# EAGLE design LPC_2TE_3.4H (EAGLE 5.00)
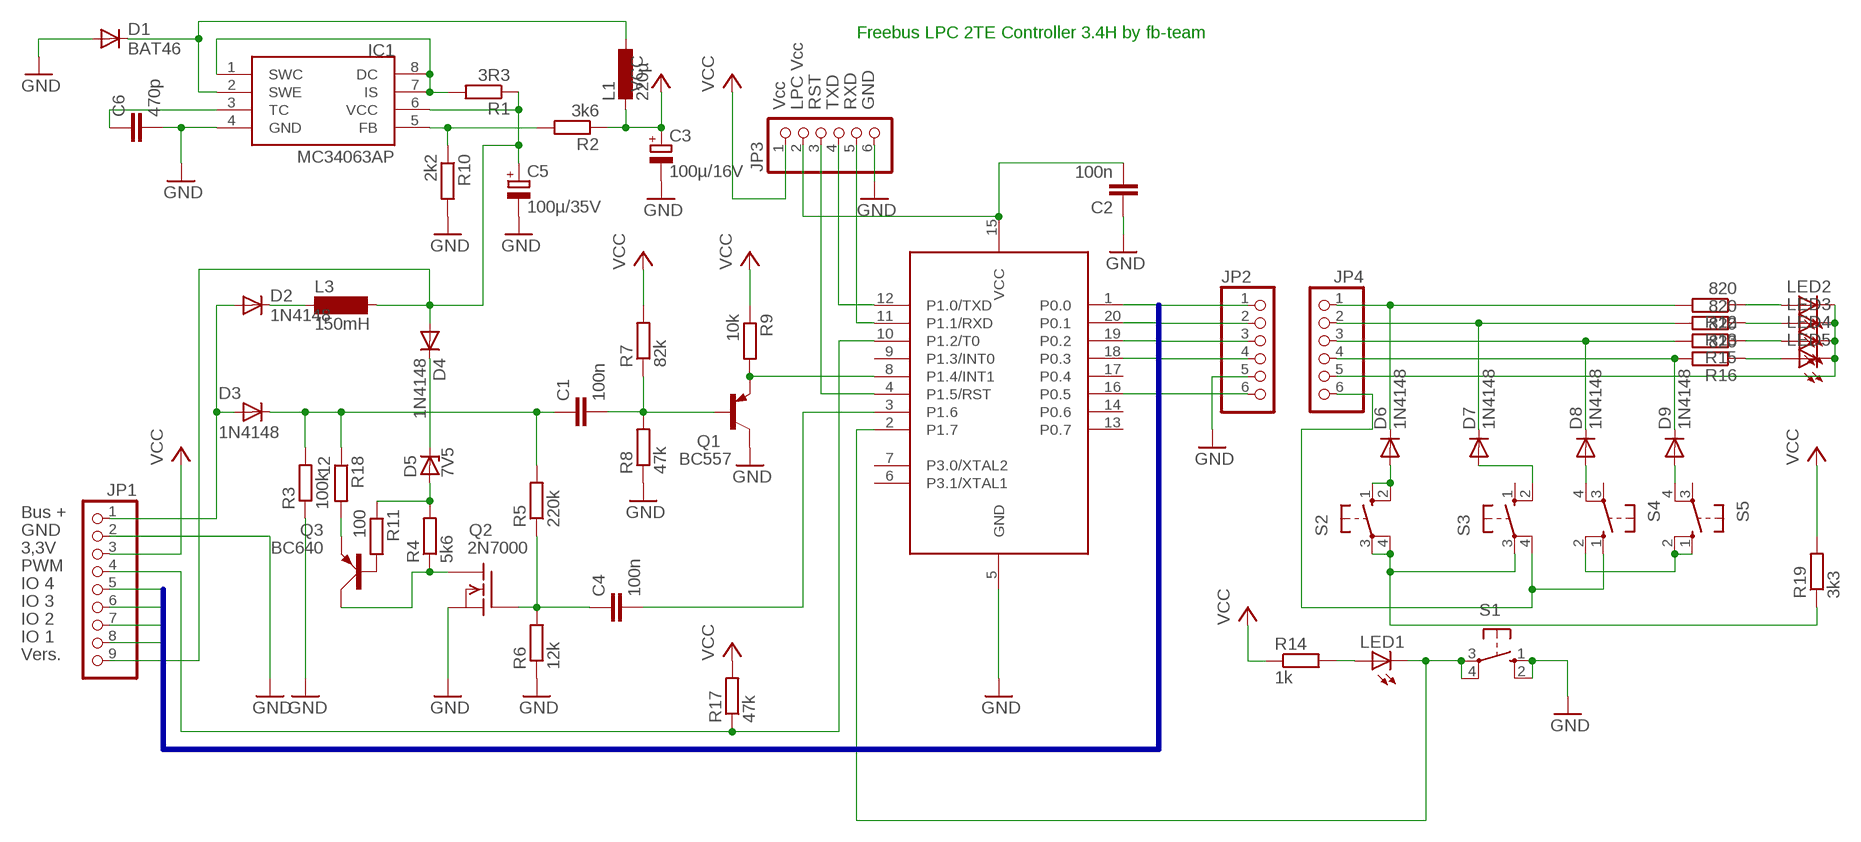
[diagram p0: schematic, sheet 1]

## Parts
C1  100n  C-EU050-024X044  [C050-024X044]
C2  100n  C-EU050-024X044  [C050-024X044]
C3  100µ/16V  CPOL-EUE3.5-8  [E3,5-8]
C4  100n  C-EU050-024X044  [C050-024X044]
C5  100µ/35V  CPOL-EUE3.5-8  [E3,5-8]
C6  470p  C-EU025-024X044  [C025-024X044]
D1  BAT46  BAT81  [DO34-7]
D2  1N4148  [DO35-10]
D3  1N4148  DO35-STEHEND  [DO35-S]
D4  1N4148  [DO35-10]
D5  7V5  ZPD  [DO35Z10]
D6  1N4148  [DO35-10]
D7  1N4148  [DO35-10]
D8  1N4148  [DO35-10]
D9  1N4148  [DO35-10]
IC1  MC34063AP  [DIL08]
JP1  PINHD-1X9  [1X09]
JP2  PINHD-1X6  [1X06]
JP3  PINHD-1X6  [1X06]
JP4  PINHD-1X6  [1X06]
L1  220µ  L-EU0207/2V  [0207/2V]
L3  150mH  BS11  [BS11]
LED1  LED3MM  [LED3MM]
LED2  LED3MM  [LED3MM]
LED3  LED3MM  [LED3MM]
LED4  LED3MM  [LED3MM]
LED5  LED3MM  [LED3MM]
Q1  BC557  [TO92]
Q2  2N7000  VN2222KM  [TO237]
Q3  BC640  [SOT54D]
R1  3R3  R-EU_0207/2V  [0207/2V@1]
R2  3k6  R-EU_0207/2V  [0207/2V@1]
R3  100k  R-EU_0207/2V  [0207/2V@1]
R4  5k6  R-EU_0207/2V  [0207/2V@1]
R5  220k  R-EU_0207/2V  [0207/2V@1]
R6  12k  R-EU_0207/2V  [0207/2V@1]
R7  82k  R-EU_0207/2V  [0207/2V@1]
R8  47k  R-EU_0207/2V  [0207/2V@1]
R9  10k  R-EU_0207/2V  [0207/2V@1]
R10  2k2  R-EU_0207/2V  [0207/2V@1]
R11  100  R-EU_0207/2V  [0207/2V@1]
R12  820  R-EU_0207/10  [0207/10@1]
R13  820  R-EU_0207/10  [0207/10@1]
R14  1k  R-EU_0207/2V  [0207/2V@1]
R15  820  R-EU_0207/10  [0207/10@1]
R16  820  R-EU_0207/10  [0207/10@1]
R17  47k  R-EU_0207/2V  [0207/2V@1]
R18  12  R-EU_0207/2V  [0207/2V@1]
R19  3k3  R-EU_0207/10  [0207/10@1]
S1  10-XX  [B3F-10XX]
S2  10-XX  [B3F-10XX]
S3  10-XX  [B3F-10XX]
S4  10-XX  [B3F-10XX]
S5  10-XX  [B3F-10XX]
U1  89LPC922  [DIL20]

## Nets
EIB+: D2.A D3.P$1(A) JP1.1
GND: C2.1 C3.- C5.- C6.2 D1.A IC1.4(GND) JP1.2 JP2.5 JP3.6 Q1.3(C) Q2.3(S) R3.1 R6.1 R8.1 R10.2 S1.1(S) S1.2(S1) U1.5(GND)
N$1: Q1.1(E) R9.2 U1.8(P1.4/INT1)
N$2: C1.2 Q1.2(B) R7.1 R8.2
N$3: D8.A S4.4(P1)
N$4: C1.1 D3.P$2(B) R3.2 R5.2 R18.1
N$5: C4.2 U1.3(P1.6)
N$6: D9.A S5.4(P1)
N$7: LED1.K(C) S1.3(P) S1.4(P1) U1.2(P1.7)
N$8: IC1.1(SWC) IC1.7(IS) IC1.8(DC) R1.2
N$9: LED1.A R14.2
N$10: C5.+ D4.A IC1.6(VCC) JP1.9 L3.2 R1.1
N$11: IC1.5(FB) R2.2 R10.1
N$12: D1.C IC1.2(SWE) L1.1
N$13: D2.C L3.1
N$14: C6.1 IC1.3(TC)
N$15: D4.C D5.C
N$16: D6.C JP4.1 R12.2
N$17: D7.C JP4.2 R13.2
N$18: D8.C JP4.3 R15.2
N$19: D9.C JP4.4 R16.2
N$20: LED2.A R12.1
N$21: LED3.A R13.1
N$22: LED4.A R15.1
N$23: LED5.A R16.1
N$24: JP4.5 LED2.K(C) LED3.K(C) LED4.K(C) LED5.K(C)
N$25: D5.A R4.2 R11.1
N$26: Q2.1(D) Q3.C R4.1
N$27: S4.2(S1) S5.1(S) S5.2(S1)
N$28: Q3.B R11.2
N$29: JP3.4 U1.12(P1.0/TXD)
N$30: JP3.5 U1.11(P1.1/RXD)
N$31: JP3.3 U1.4(P1.5/RST)
N$32: C2.2 JP3.2 U1.15(VCC)
N$33: Q3.E R18.2
N$34: C4.1 Q2.2(G) R5.1 R6.2
N$35: R19.1 S2.3(P) S2.4(P1) S3.3(P)
N$36: D6.A S2.1(S) S2.2(S1)
N$37: D7.A S3.2(S1)
N$40: JP4.6 S3.4(P1) S4.1(S)
N$42: JP2.6 U1.16(P0.5)
P0.0: JP1.8 JP2.1 U1.1(P0.0)
P0.1: JP1.7 JP2.2 U1.20(P0.1)
P0.2: JP1.6 JP2.3 U1.19(P0.2)
P0.3: JP1.5 JP2.4 U1.18(P0.3)
PWM: JP1.4 R17.1 U1.10(P1.2/T0)
VCC: C3.+ JP1.3 JP3.1 L1.2 R2.1 R7.2 R9.1 R14.1 R17.2 R19.2
Unconnected: S3.1(S) S4.3(P) S5.3(P) U1.6(P3.1/XTAL1) U1.7(P3.0/XTAL2) U1.9(P1.3/INT0) U1.13(P0.7) U1.14(P0.6) U1.17(P0.4)

## Buses
P0.[0..3]

## Notes on the sheet
- Freebus LPC 2TE Controller 3.4H by fb-team
- Vcc | LPC Vcc | RST | TXD | RXD | GND
- Bus +
- GND
- 3,3V
- PWM
- IO 4
- IO 3
- IO 2
- IO 1
- Vers.

## Library data of the parts
C1 C2 C4 C6 = rcl:C-EU: CAPACITOR, European symbol
C3 C5 = rcl:CPOL-EU: POLARIZED CAPACITOR, European symbol
D1 = diode:BAT81: DIODE barrier diode
D2 D4 D6-D9 = diode:1N4148: DIODE high speed (Philips)
D3 = kubi:DO35-STEHEND
D5 = diode:ZPD: Z DIODE 500 mW
IC1 = mc34063:MC34063
JP1 = pinhead:PINHD-1X9: PIN HEADER
JP2-JP4 = pinhead:PINHD-1X6: PIN HEADER
L1 = rcl:L-EU: INDUCTOR, European symbol
L3 = inductor-neosid:BS: INDUCTOR nominal inductance, magnetically screened
LED1-LED5 = led:LED: LED OSRAM: - CHIPLED LG R971, LG N971, LY N971, LG Q971, LY Q971, LO R971, LY R971 LH N974, LH R974 LS Q976, LO Q976, LY Q976 LO Q996 - Hyper CHIPLED LW Q18S LB Q993, LB Q99A, LB R99A - SideLED LS A670, LO A670, LY A670, LG A670, LP A670 LB A673, LV A673, LT A673, LW A673 LH A674 LY A675 LS A676, LA A676, LO A676, LY A676, LW A676 LS A679, LY A679, LG A679 - Hyper Micro SIDELED® LS Y876, LA Y876, LO Y876, LY Y876 LT Y87S - SmartLED LW L88C, LW L88S LB L89C, LB L89S, LG L890 LS L89K, LO L89K, LY L89K LS L896, LA L896, LO L896, LY L896 - TOPLED LS T670, LO T670, LY T670, LG T670, LP T670 LSG T670, LSP T670, LSY T670, LOP T670, LYG T670 LG T671, LOG T671, LSG T671 LB T673, LV T673, LT T673, LW T673 LH T674 LS T676, LA T676, LO T676, LY T676, LB T676, LH T676, LSB T676, LW T676 LB T67C, LV T67C, LT T67C, LS T67K, LO T67K, LY T67K, LW E67C LS E67B, LA E67B, LO E67B, LY E67B, LB E67C, LV E67C, LT E67C LW T67C LS T679, LY T679, LG T679 LS T770, LO T770, LY T770, LG T770, LP T770 LB T773, LV T773, LT T773, LW T773 LH T774 LS E675, LA E675, LY E675, LS T675 LS T776, LA T776, LO T776, LY T776, LB T776 LHGB T686 LT T68C, LB T68C - Hyper Mini TOPLED® LB M676 - Mini TOPLED Santana® LG M470 LS M47K, LO M47K, LY M47K Source: http://www.osram.convergy.de - LUMILED® LXK2-PW12-R00, LXK2-PW12-S00, LXK2-PW14-U00, LXK2-PW14-V00 LXK2-PM12-R00, LXK2-PM12-S00, LXK2-PM14-U00 LXK2-PE12-Q00, LXK2-PE12-R00, LXK2-PE12-S00, LXK2-PE14-T00, LXK2-PE14-U00 LXK2-PB12-K00, LXK2-PB12-L00, LXK2-PB12-M00, LXK2-PB14-N00, LXK2-PB14-P00, LXK2-PB14-Q00 LXK2-PR12-L00, LXK2-PR12-M00, LXK2-PR14-Q00, LXK2-PR14-R00 LXK2-PD12-Q00, LXK2-PD12-R00, LXK2-PD12-S00 LXK2-PH12-R00, LXK2-PH12-S00 LXK2-PL12-P00, LXK2-PL12-Q00, LXK2-PL12-R00 Source: www.luxeon.com
Q1 = transistor-pnp:BC557: PNP Transistor
Q2 = transistor-fet:VN2222KM: N-Channel Enhancement MOSFET (VMOS); 60V; 0,5A; 7,5Ohm
Q3 = transistor-small-signal:BC640: PNP TRANSISTOR
R1-R19 = rcl:R-EU_: RESISTOR, European symbol
S1-S5 = switch-omron:10-XX: OMRON SWITCH
U1 = micro-philips:89LPC922

## Board
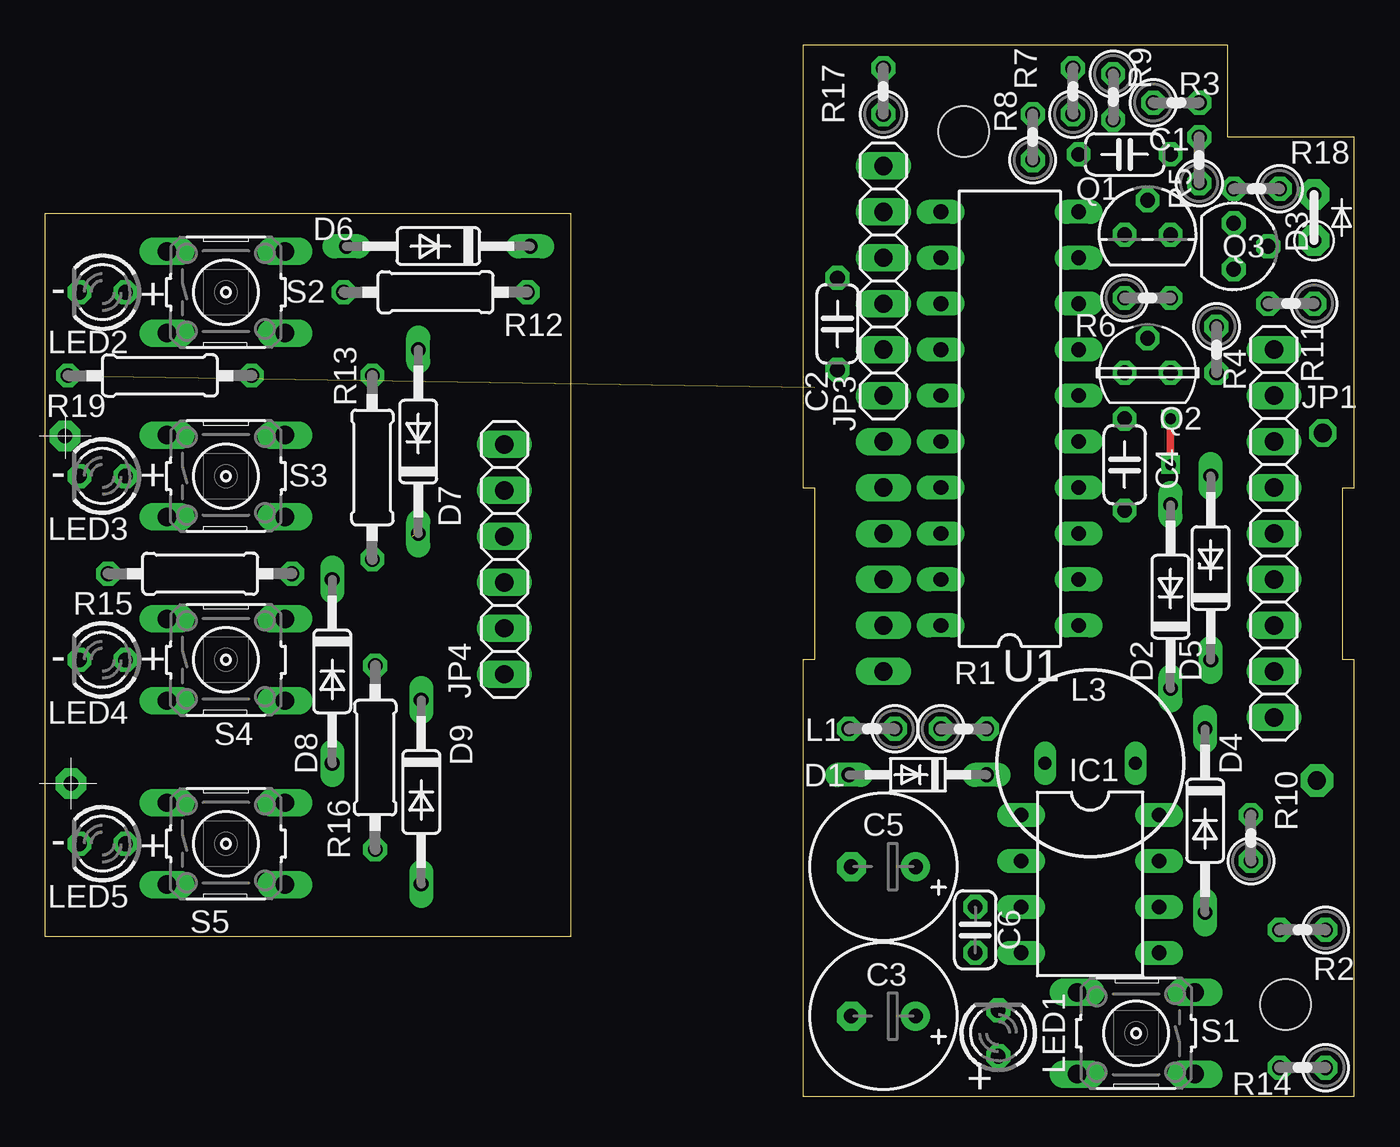
[diagram p1: board, top side]
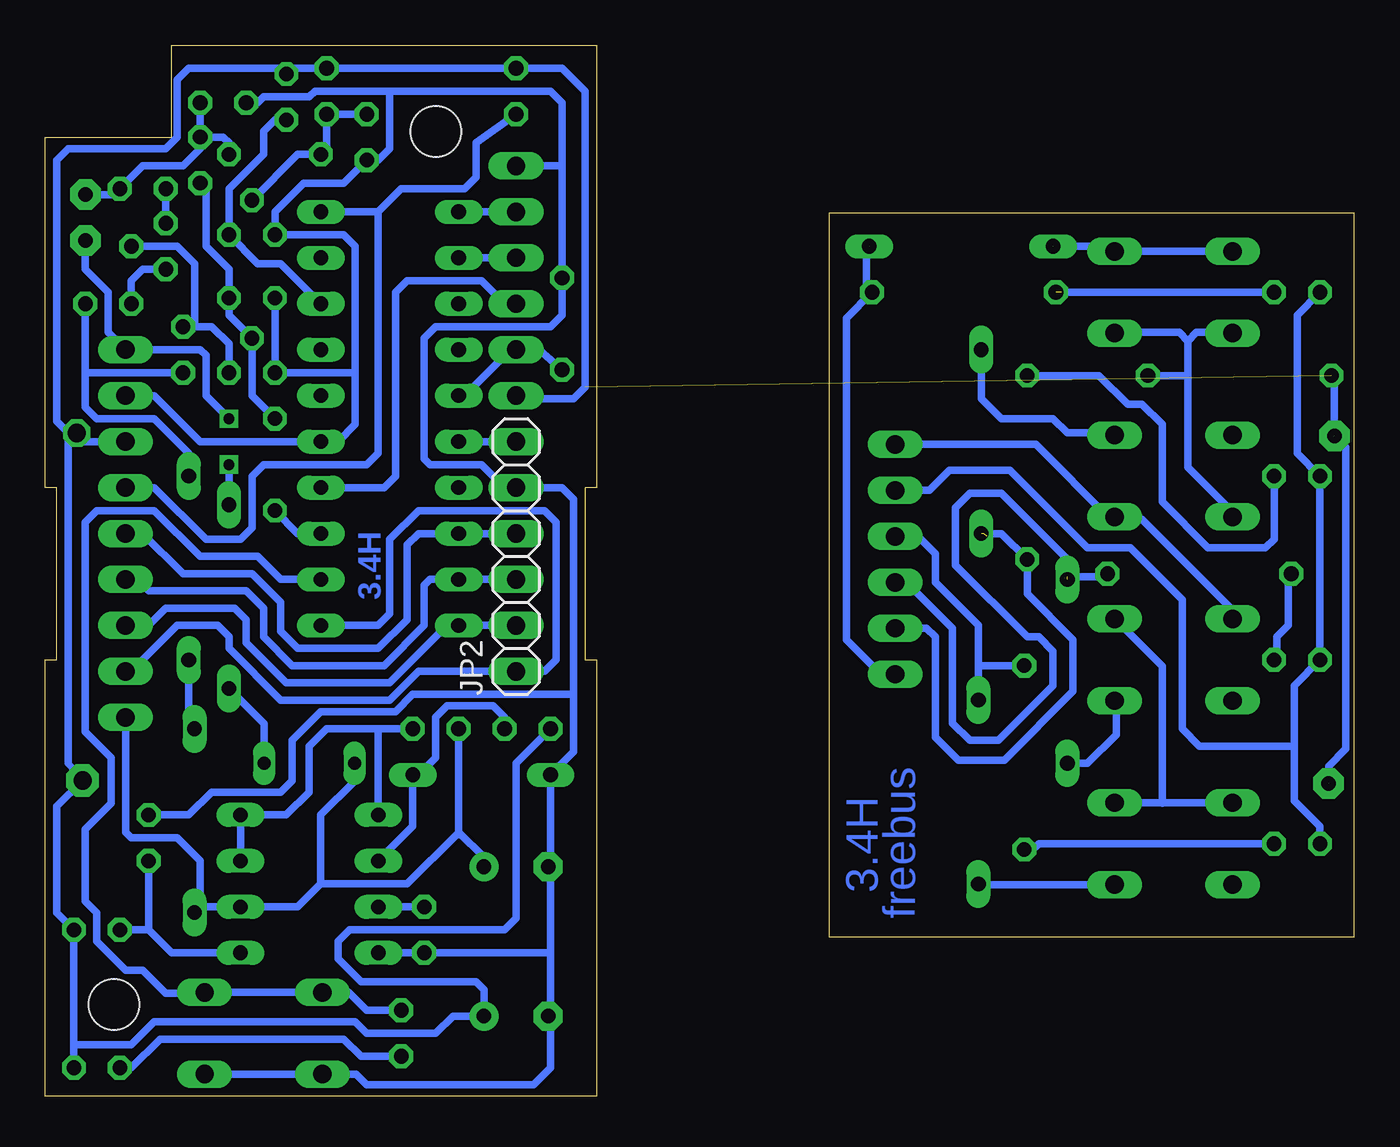
[diagram p2: board, bottom side, seen from below]

Size 72.38 x 58.1 mm. Coordinates in mm from the lower left corner, seen from the top.
Outline: 0,48.83 29.05,48.83
Outline: 29.05,48.83 29.05,8.83
Outline: 29.05,8.83 0,8.83
Outline: 0,8.83 0,48.83
Outline: 41.9,0 72.38,0 72.38,24.13 71.74,24.13 71.74,33.66 72.38,33.66 72.38,53.02 65.39,53.02 65.39,58.1 41.9,58.1 41.9,33.66 42.53,33.66 42.53,24.13 41.9,24.13 41.9,0
Copper layers (1*16): Top 0.035mm / dielectric 1.5mm / Bottom 0.035mm
Design rules "default *": minimum track width 10mil, minimum drill 24mil, track to track 12mil, track to pad 12mil, pad to pad 12mil, via to via 12mil, smd to smd 8mil, copper to edge 12mil, drill to drill 8mil, minimum pad ring 10mil, minimum via ring 8mil, stop-mask expansion 4mil, vias tented up to drill 0mil, thermal gap 10mil
Holes 2.8 mm at 68.57,5.08 50.79,53.34

### Footprints (pad centres in the part's own frame; a part is rotated, then mirrored left to right if it is on the bottom)
C050-024X044 = drill 0.813 octagon: 1 -2.54,0; 2 2.54,0
E3,5-8 = drill 0.813 pad 1.6 round: + -1.778,0 | drill 0.813 pad 1.6 octagon: - 1.778,0
C025-024X044 = drill 0.813 octagon: 1 -1.27,0; 2 1.27,0
DO34-7 = drill 0.813 long: A 3.81,0; C -3.81,0
DO35-10 = drill 0.813 long: A 5.08,0; C -5.08,0
DO35-S = drill 0.8 pad 1.676 octagon: P$1 -1.27,0; P$2 1.27,0
DO35Z10 = drill 0.813 long: A 5.08,0; C -5.08,0
DIL08 = drill 0.813 long: 1 -3.81,-3.81; 2 -1.27,-3.81; 3 1.27,-3.81; 4 3.81,-3.81; 5 3.81,3.81; 6 1.27,3.81; 7 -1.27,3.81; 8 -3.81,3.81
1X09 = drill 1.016 long: 1 -10.16,0; 2 -7.62,0; 3 -5.08,0; 4 -2.54,0; 5 0,0; 6 2.54,0; 7 5.08,0; 8 7.62,0; 9 10.16,0
1X06 = drill 1.016 long: 1 -6.35,0; 2 -3.81,0; 3 -1.27,0; 4 1.27,0; 5 3.81,0; 6 6.35,0
0207/2V = drill 0.813 octagon: 1 -1.27,0; 2 1.27,0
BS11 = drill 0.7 long: 1 -2.5,0; 2 2.5,0
LED3MM = drill 0.813 octagon: A -1.27,0; K 1.27,0
TO92 = drill 0.813 octagon: 1 1.27,0; 2 0,1.905; 3 -1.27,0
TO237 = drill 0.813 octagon: 1 1.27,0; 2 0,1.905; 3 -1.27,0
SOT54D = drill 0.813 octagon: B 1.27,0; C 0,1.905; E -1.27,0
0207/2V@1 = drill 0.813 octagon: 1 -1.27,0; 2 1.27,0
0207/10@1 = drill 0.813 octagon: 1 -5.08,0; 2 5.08,0
B3F-10XX = drill 1.016 long: 1 -3.251,2.261; 2 3.251,2.261; 3 -3.251,-2.261; 4 3.251,-2.261
DIL20 = drill 0.813 long: 1 -11.43,-3.81; 2 -8.89,-3.81; 3 -6.35,-3.81; 4 -3.81,-3.81; 5 -1.27,-3.81; 6 1.27,-3.81; 7 3.81,-3.81; 8 6.35,-3.81; 9 8.89,-3.81; 10 11.43,-3.81; 11 11.43,3.81; 12 8.89,3.81; 13 6.35,3.81; 14 3.81,3.81; 15 1.27,3.81; 16 -1.27,3.81; 17 -3.81,3.81; 18 -6.35,3.81; 19 -8.89,3.81; 20 -11.43,3.81

### Placement (x,y rotation side)
C1  59.68,52.07 180 top
C2  43.81,42.7 270 top
C3  46.34,4.45 180 top
C4  59.68,34.92 270 top
C5  46.34,12.7 180 top
C6  51.43,9.21 270 top
D1  48.25,17.78 180 top
D2  62.22,27.62 90 top
D3  70.16,48.58 90 top
D4  64.12,15.24 270 top
D5  64.44,29.21 90 top
D6  21.74,46.99 180 top
D7  20.63,36.19 90 top
D8  15.87,23.5 270 top
D9  20.79,16.83 270 top
IC1  57.77,11.75 270 top
JP1  67.94,31.11 270 top
JP2  46.34,29.85 90 bottom
JP3  46.34,45.08 90 top
JP4  25.39,29.69 90 top
L1  45.71,20.32 180 top
L3  57.77,18.41 180 top
LED1  52.7,3.49 90 top
LED2  3.16,44.45 180 top
LED3  3.16,34.29 180 top
LED4  3.16,24.13 180 top
LED5  3.16,13.97 180 top
Q1  60.95,47.62 0 top
Q2  60.95,40 0 top
Q3  65.71,46.99 270 top
R1  50.79,20.32 0 top
R2  69.52,9.21 180 top
R3  62.54,54.93 0 top
R4  64.76,41.28 270 top
R5  63.81,51.75 90 top
R6  60.95,44.13 0 top
R7  56.82,55.56 90 top
R8  54.6,53.02 90 top
R9  59.05,55.24 270 top
R10  66.67,14.29 90 top
R11  68.89,43.81 180 top
R12  21.58,44.45 0 top
R13  18.09,34.77 270 top
R14  69.52,1.59 180 top
R15  8.56,28.89 0 top
R16  18.25,18.73 90 top
R17  46.34,55.56 90 top
R18  66.98,50.17 180 top
R19  6.34,39.85 180 top
S1  60.32,3.49 180 top
S2  9.99,44.45 0 top
S3  9.99,34.29 0 top
S4  9.99,24.13 0 top
S5  9.99,13.97 0 top
U1  53.33,37.47 90 top

### Tracks (layer width: path | path; a pad name or v marks a point on that pad's centre or on a via)
EIB+  (via drill 0.6)
  Top 0.406: v62.22,37.47 v62.22,34.93
  Bottom 0.406: D3.P$1 70.16,45.72 68.89,44.45 68.89,42.23 JP1.1 63.81,41.28 63.49,40.96 63.49,38.74 v62.22,37.47 | D2.A v62.22,34.93
GND
  Bottom 0.406: 55.23,40.01 Q2.3 R6.1 | 55.23,40.01 55.23,46.99 55.87,47.63 Q1.3 59.68,48.9 58.09,50.48 55.87,50.48 R8.1 53.96,51.75 53.33,52.39 53.33,55.56 | S1.1 57.18,1.23 57.14,1.27 57.06,1.19 S1.2 55.2,1.23 54.6,0.64 45.39,0.64 44.44,1.59 44.44,4.45 | 55.23,40.01 55.23,37.15 56.19,36.2 U1.5 63.81,36.2 66.35,38.74 JP1.2 | C2.1 43.8,43.18 44.44,42.55 50.79,42.55 51.42,41.91 51.42,35.24 51.11,34.93 48.25,34.93 46.98,33.66 JP2.5 43.8,33.66 43.17,33.02 43.17,22.23 | C2.1 43.8,51.44 | 43.8,51.44 JP3.6 | 53.33,55.56 44.44,55.56 43.8,54.93 43.81,54.93 43.81,51.44 43.8,51.44 | IC1.4 C6.2 44.44,7.94 | 43.17,22.23 43.17,19.05 D1.A 44.44,12.7 | 44.44,12.7 C5.- | 44.44,4.45 C3.- | 44.44,7.94 44.44,12.7 | 44.44,4.45 44.44,7.94 | R3.1 60.63,54.93 60.31,55.25 57.77,55.25 57.46,55.56 53.33,55.56 | R10.2 64.44,15.56 63.17,16.83 59.36,16.83 58.73,17.46 58.73,19.69 57.14,21.27 53.01,21.27 52.06,22.23 43.17,22.23 | C2.1 43.96,45.24 C2.1
N$1
  Bottom 0.406: U1.8 59.36,46.04 60.63,46.04 Q1.1 62.22,50.17 60.31,52.07 60.31,53.34 59.68,53.98 R9.2
N$2
  Bottom 0.406: R8.2 R7.1 56.82,52.39 C1.2 58.41,52.07 Q1.2
N$3
  Bottom 0.406: D8.A 14.75,18.42 13.17,20 13.17,21.91 13.2,21.87 S4.4
N$4
  Bottom 0.406: R5.2 63.81,52.39 64.76,51.44 66.98,51.44 R18.1 68.57,49.85 D3.P$2 | C1.1 62.22,52.71 62.54,53.02 R5.2 | R5.2 R3.2
N$5
  Bottom 0.406: C4.2 58.41,31.12 U1.3
N$6
  Bottom 0.406: D9.A 20.63,11.75 20.59,11.71 S5.4
N$7
  Bottom 0.406: 70.16,10.8 69.52,10.16 69.52,8.57 67.93,6.99 66.98,6.99 65.71,5.72 63.49,5.72 63.53,5.75 S1.3 57.42,5.75 57.14,6.03 57.06,5.96 S1.4 55.59,5.75 54.6,4.76 LED1.K | U1.2 59.36,28.58 60.63,29.85 63.81,29.85 66.35,32.39 69.52,32.39 70.16,31.75 70.16,20.16 68.73,18.73 68.73,16.19 70.16,14.76 70.16,10.8 | 70.16,10.8
N$8
  Bottom 0.406: IC1.7 IC1.8 59.04,15.56 57.77,16.83 57.77,19.37 56.82,20.32 53.96,20.32 | 53.96,20.32 R1.2 | IC1.1 53.96,20.32
N$9
  Bottom 0.406: LED1.A 54.92,2.22 55.87,3.18 66.03,3.18 67.62,1.59 R14.2
N$10
  Bottom 0.406: 57.14,11.75 58.41,10.48 IC1.6 63.81,10.48 | 57.14,11.75 52.38,11.75 49.65,14.48 49.52,14.48 49.52,14.61 | L3.2 55.27,17.42 57.14,15.56 57.14,11.75 | 63.81,10.48 D4.A | 49.52,14.61 R1.1 | C5.+ 48.12,13.21 49.52,14.61 | 63.81,10.48 63.81,13.02 65.08,14.29 67.62,14.29 67.93,14.61 JP1.9
N$11
  Bottom 0.406: IC1.5 65.39,7.94 66.66,9.21 | 66.66,9.21 R10.1 | 66.66,9.21 R2.2
N$12
  Bottom 0.406: IC1.2 52.06,14.92 D1.C 51.74,17.78 50.79,18.73 50.79,20.96 50.15,21.59 47.61,21.59 46.98,20.96 L1.1
N$13
  Bottom 0.406: L3.1 60.27,20.6 D2.C
N$14
  Bottom 0.406: C6.1 IC1.3
N$15
  Bottom 0.406: D4.C 64.44,20.96 D5.C
N$16  (1 unrouted)
  Bottom 0.406: D6.C 26.98,46.99 26.98,44.77 R12.2 28.09,43.02 28.09,25.24 26.34,23.5 25.39,23.5 JP4.1
N$17  (2 unrouted)
  Bottom 0.406: JP4.2 23.64,25.88 23.17,25.4 23.17,19.84 21.9,18.57 19.36,18.57 15.55,22.38 15.55,25.24 18.09,27.78 R13.2 19.52,31.12 20.47,31.12 | 20.31,30.96
N$18  (1 unrouted)
  Bottom 0.406: R15.2 14.12,28.73 15.86,28.73 | JP4.3 25.23,28.26 24.6,28.26 22.21,25.88 22.21,20.64 21.26,19.69 19.67,19.69 16.66,22.7 16.66,24.61 17.45,25.4 17.61,25.4 18.09,25.4 22.06,29.37 22.06,32.54 21.26,33.34 20.15,33.34 19.52,33.34 15.86,29.69 15.87,29.69 D8.C | D8.C
N$19
  Bottom 0.406: JP4.4 24.12,30.96 23.17,30 23.17,28.42 20.79,26.04 20.79,23.81 | R16.2 | R16.2 20.79,23.81 | 20.79,23.81 | 20.79,23.81 D9.C | 20.79,23.81
N$20  (1 unrouted)
  Bottom 0.406: LED2.A 16.18,44.45
N$21
  Bottom 0.406: LED3.A | LED3.A 4.43,30.8 4.91,30.32 8.09,30.32 10.63,32.86 10.63,34.45 | 10.63,34.45 10.63,37.15 11.74,38.26 12.53,38.26 14.12,39.85 R13.1 | 10.63,34.45
N$22
  Bottom 0.406: R15.1 3.64,29.05 3.64,26.04 4.28,25.4 4.28,24.29 LED4.A
N$23
  Bottom 0.406: LED5.A 4.43,14.13 4.59,13.97 17.45,13.97 17.61,13.81 18.25,13.81 R16.1
N$24
  Bottom 0.406: LED2.K 3.16,43.18 3.16,35.56 LED3.K LED4.K 3.32,22.7 3.32,19.37 | 3.32,19.37 3.32,16.35 1.89,14.92 LED5.K | LED5.K | JP4.5 23.48,33.5 22.37,34.61 19.52,34.61 19.04,34.61 18.4,33.97 14.75,30.32 12.37,30.32 9.51,27.46 9.51,20.32 8.56,19.37 3.32,19.37
N$25
  Bottom 0.406: D5.A 64.44,35.56 66.35,37.47 69.52,37.47 70.16,38.1 70.16,40.01 | 70.16,40.01 R11.1 | 70.16,40.01 R4.2
N$26
  Bottom 0.406: Q3.C 65.08,46.99 64.12,46.04 64.12,42.55 | Q2.1 62.22,41.59 63.17,42.55 64.12,42.55 | 64.12,42.55 R4.1
N$27
  Bottom 0.406: S5.1 10.63,16.23 | 10.63,16.23 S5.2 13.29,16.23 13.32,16.19 | S4.2 10.63,23.77 10.63,16.23 | 10.63,16.23 10.63,16.19
N$28
  Bottom 0.406: R11.2 67.62,45.09 66.98,45.72 Q3.B
N$29
  Bottom 0.406: JP3.4 U1.12
N$30
  Bottom 0.406: JP3.5 U1.11
N$31
  Bottom 0.406: U1.4 53.65,33.66 53.01,34.29 53.01,44.45 52.38,45.09 48.25,45.09 46.98,43.82 JP3.3
N$32
  Bottom 0.406: U1.15 49.2,38.74 46.66,41.28 JP3.2 45.08,41.28 C2.2
N$33
  Bottom 0.406: Q3.E R18.2
N$34
  Bottom 0.406: C4.1 60.95,38.74 Q2.2 62.22,43.18 R6.2 62.22,45.72 63.49,46.99 63.49,50.17 R5.1
N$35
  Bottom 0.406: S3.3 6.74,32.31 9.2,34.77 9.2,39.85 | 9.2,39.85 9.2,41.75 | 9.2,41.75 9.67,42.23 13.17,42.23 13.2,42.19 S2.4 | 9.2,41.75 | 9.2,41.75 8.72,42.23 6.82,42.23 6.78,42.19 S2.3 | R19.1 | 9.2,39.85 R19.1
N$36  (1 unrouted)
  Bottom 0.406: 13.48,46.67 13.45,46.71 S2.2 13.29,46.71 | 13.48,46.67 | S2.1 13.29,46.71 | 13.29,46.71 13.32,46.67 | 13.48,46.67 13.8,46.99 D6.A
N$37
  Bottom 0.406: S3.2 13.32,36.63 13.32,36.67 15.87,36.67 16.66,37.47 19.52,37.47 20.47,38.42 | 20.47,38.42 | D7.A 20.63,38.58 20.47,38.42
N$40
  Bottom 0.406: JP4.6 17.61,36.04 13.48,31.91 13.36,31.91 S3.4 13.24,31.99 13.32,31.91 11.74,31.91 | S4.1 6.74,26.91 11.74,31.91 | 11.74,31.91
N$42
  Bottom 0.406: U1.16 | U1.16 | JP2.6 U1.16
P0.0
  Bottom 0.406: U1.1 53.96,26.04 53.33,26.67 53.33,30.8 51.74,32.39 44.76,32.39 44.12,31.75 44.12,24.13 44.76,23.5 JP2.1 51.74,23.5 53.33,21.91 59.36,21.91 62.22,24.77 62.22,25.4 62.85,26.04 65.08,26.04 67.62,23.5 JP1.8
P0.1
  Bottom 0.406: JP1.7 66.66,26.04 65.71,26.99 61.9,26.99 61.27,26.35 61.27,25.08 59.04,22.86 53.33,22.86 50.15,26.04 U1.20 JP2.2
P0.2
  Bottom 0.406: JP1.6 67.3,28.58 66.66,27.94 61.27,27.94 60.31,26.99 60.31,25.4 58.73,23.81 53.65,23.81 51.42,26.04 51.42,28.26 51.11,28.58 U1.19 JP2.3
P0.3
  Bottom 0.406: JP1.5 66.98,31.12 64.76,28.89 60.95,28.89 59.36,27.31 59.36,25.72 58.41,24.77 53.96,24.77 52.38,26.35 52.38,30.48 51.74,31.12 U1.18 JP2.4
PWM
  Bottom 0.406: 53.96,48.9 53.96,35.56 54.6,34.93 60.31,34.93 60.95,34.29 60.95,31.43 61.58,30.8 63.49,30.8 66.35,33.66 JP1.4 | 53.96,48.9 U1.10 | 53.96,48.9 52.69,50.17 49.2,50.17 48.57,50.8 48.57,52.71 R17.1
VCC  (via drill 0.8 pad 1.68, 1, 1 pad 1.78)  (3 unrouted)
  Bottom 0.406: JP3.1 46.19,38.58 45.07,38.58 43.17,38.58 42.53,39.21 42.53,55.56 43.8,56.83 R17.2 | R17.2 R7.2 59.04,56.83 | 59.04,56.83 64.44,56.83 65.08,56.2 65.08,53.02 65.71,52.39 71.11,52.39 71.74,51.75 71.74,37.31 70.95,36.51 | 59.04,56.83 R9.1 | 70.79,2.86 R14.1 | 70.79,2.86 R2.1 71.74,10.16 71.74,16.03 v70.32,17.46 71.11,18.42 71.11,20 71.11,34.29 71.11,36.35 v70.63,36.67 | 70.79,2.86 67.62,2.86 66.35,4.13 55.23,4.13 54.6,3.49 50.79,3.49 49.84,4.45 C3.+ 48.12,5.91 48.57,6.35 54.92,6.35 56.19,7.62 56.19,8.57 55.55,9.21 46.98,9.21 46.34,9.84 46.34,18.42 L1.2 | v70.63,36.67 70.95,36.35 | JP1.3 70.79,36.2 70.95,36.35 | v70.63,36.67 70.95,36.35 | 70.95,36.35 71.11,36.51 | 70.95,36.51 | v70.63,36.67 70.95,36.51 | R19.2 1.1,39.53 1.1,38.42 v1.1,36.51 0.47,35.88 0.47,19.21 | 0.47,19.21 1.42,18.26 v1.42,17.3 | 0.47,19.21 | R17.2

### Text on the board
Bottom: 3.4H | 3.4H | freebus
tPlace: - | + | - | + | - | + | - | + | +